# EAGLE design pic18f4550_dev (EAGLE 7.2.0)
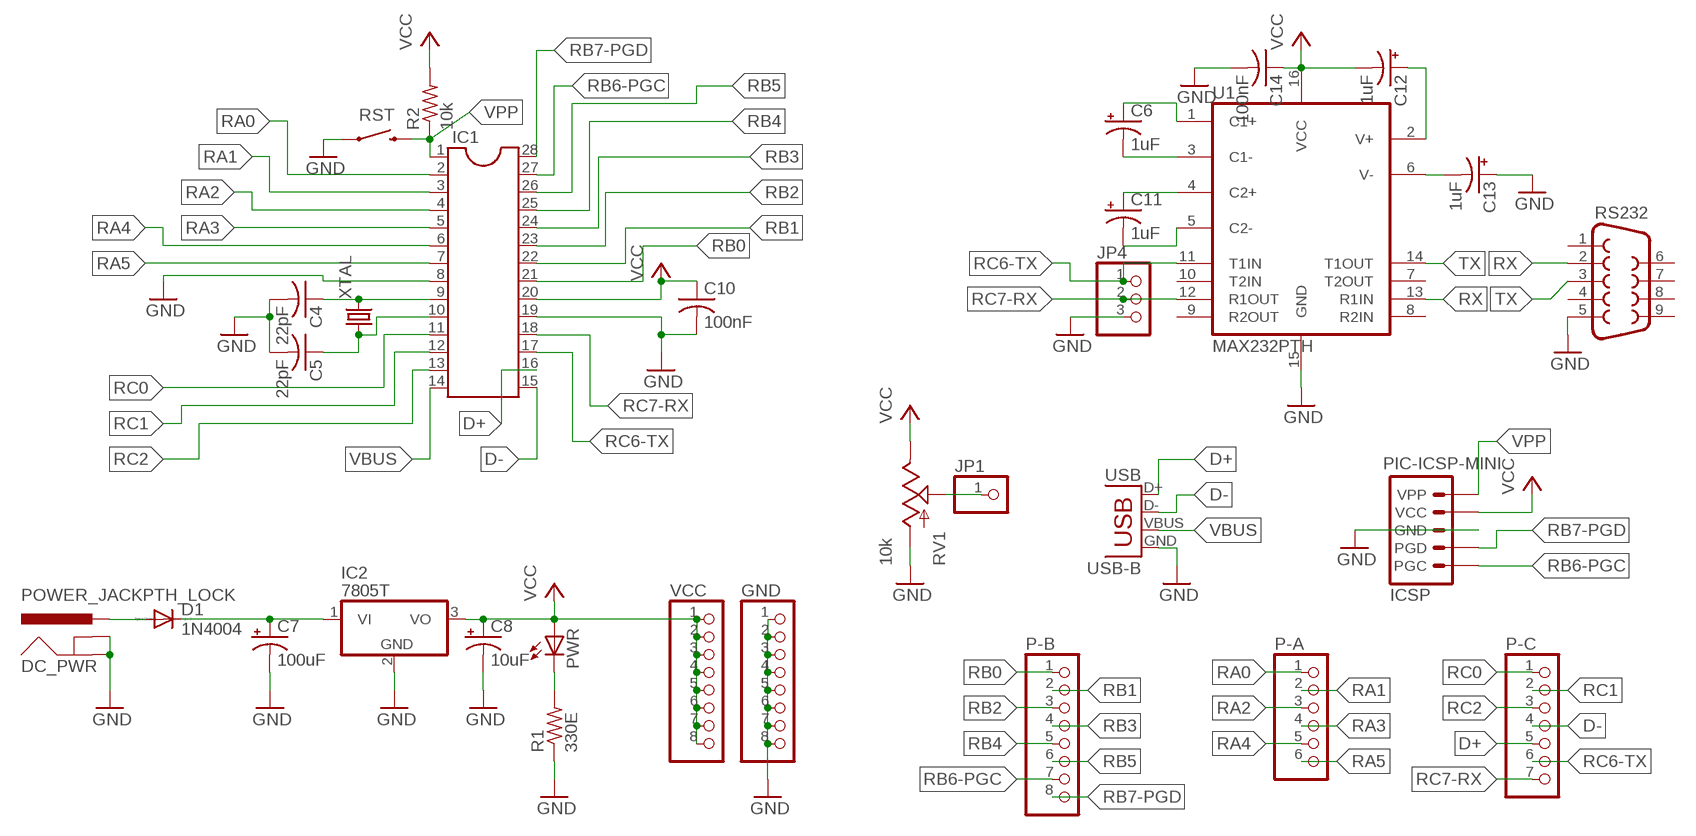
[diagram p0: schematic, sheet 1]

## Parts
C4  22pF  C-US025-024X044  [C025-024X044]
C5  22pF  C-US025-024X044  [C025-024X044]
C6  1uF  CAP_POLPTH2  [CPOL-RADIAL-10UF-25V]
C7  100uF  CAP_POLPTH1  [CPOL-RADIAL-100UF-25V]
C8  10uF  CAP_POLPTH2  [CPOL-RADIAL-10UF-25V]
C10  100nF  C-US025-025X050  [C025-025X050]
C11  1uF  CAP_POLPTH2  [CPOL-RADIAL-10UF-25V]
C12  1uF  CAP_POLPTH2  [CPOL-RADIAL-10UF-25V]
C13  1uF  CAP_POLPTH2  [CPOL-RADIAL-10UF-25V]
C14  100nF  C-US025-025X050  [C025-025X050]
D1  1N4004  [DO41-10]
DC_PWR  POWER_JACKPTH_LOCK  [POWER_JACK_PTH_LOCK]
GND  PINHD-1X8  [1X08]
IC1  DIL28-3  [DIL28-3]
IC2  7805T  [TO220H]
ICSP  PIC-ICSP-MINI  [PIC-ICSP-MINI]
JP1  PINHD-1X1  [1X01]
JP4  PINHD-1X3  [1X03]
P-A  PINHD-1X6  [1X06]
P-B  PINHD-1X8  [1X08]
P-C  PINHD-1X7  [1X07]
PWR  LED5MM  [LED5MM]
R1  330E  R-US_0204/7  [0204/7]
R2  10k  R-US_0204/7  [0204/7]
RS232  DB9FEMALE  [DB9]
RST  SWITCH-MOMENTARY-2PTH  [TACTILE-PTH]
RV1  10k  POTTRIM  [TRIM_POT]
U1  MAX232PTH  [DIL16]
USB  USB-B  USBPTH  [USB-B-PTH]
VCC  PINHD-1X8  [1X08]
XTAL  CRYSTALHC49S  [HC49/S]

## Nets
D+: IC1.16 P-C.5 USB.D+
D-: IC1.15 P-C.4 USB.D-
GND: C4.2 C5.2 C7.2(-) C8.2(-) C10.2 C13.1(+) C14.2 DC_PWR.GND DC_PWR.GNDBREAK GND.1 GND.2 GND.3 GND.4 GND.5 GND.6 GND.7 GND.8 IC1.8 IC1.19 IC2.2(GND) ICSP.3(GND) JP4.3 R1.1 RS232.5 RST.1 RV1.3(A) U1.15(GND) USB.GND
N$1: C6.1(+) U1.1(C1+)
N$2: C4.1 IC1.9 XTAL.2
N$3: C5.1 IC1.10 XTAL.1
N$4: C7.1(+) D1.C IC2.1(VI)
N$5: C6.2(-) U1.3(C1-)
N$6: C11.1(+) U1.4(C2+)
N$7: C11.2(-) U1.5(C2-)
N$8: C12.1(+) U1.2(V+)
N$9: C13.2(-) U1.6(V-)
N$10: PWR.K(C) R1.2
N$11: D1.A DC_PWR.PWR
N$12: JP1.1 RV1.1(S)
RA0: IC1.2 P-A.1
RA1: IC1.3 P-A.2
RA2: IC1.4 P-A.3
RA3: IC1.5 P-A.4
RA4: IC1.6 P-A.5
RA5: IC1.7 P-A.6
RB0: IC1.21 P-B.1
RB1: IC1.22 P-B.2
RB2: IC1.23 P-B.3
RB3: IC1.24 P-B.4
RB4: IC1.25 P-B.5
RB5: IC1.26 P-B.6
RB6-PGC: IC1.27 ICSP.5(PGC) P-B.7
RB7-PGD: IC1.28 ICSP.4(PGD) P-B.8
RC0: IC1.11 P-C.1
RC1: IC1.12 P-C.2
RC2: IC1.13 P-C.3
RC6-TX: IC1.17 JP4.1 P-C.6 U1.11(T1IN)
RC7-RX: IC1.18 JP4.2 P-C.7 U1.12(R1OUT)
RX: RS232.2 U1.13(R1IN)
TX: RS232.3 U1.14(T1OUT)
VBUS: IC1.14 USB.VBUS
VCC: C8.1(+) C10.1 C12.2(-) C14.1 IC1.20 IC2.3(VO) ICSP.2(VCC) PWR.A R2.2 RV1.2(E) U1.16(VCC) VCC.1 VCC.2 VCC.3 VCC.4 VCC.5 VCC.6 VCC.7 VCC.8
VPP: IC1.1 ICSP.1(VPP) R2.1 RST.3
Unconnected: RS232.1 RS232.4 RS232.6 RS232.7 RS232.8 RS232.9 U1.7(T2OUT) U1.8(R2IN) U1.9(R2OUT) U1.10(T2IN)

## Library data of the parts
C4 C5 C10 C14 = resistor:C-US: CAPACITOR, American symbol
C6-C8 C11-C13 = SparkFun-Capacitors:CAP_POL: Capacitor Polarized These are standard SMD and PTH capacitors. Normally 10uF, 47uF, and 100uF in electrolytic and tantalum varieties. Always verify the external diameter of the through hole cap, it varies with capacity, voltage, and manufacturer. The EIA devices should be standard.
D1 = diode:1N4004: DIODE general purpose rectifier, 1 A
DC_PWR = SparkFun-Connectors:POWER_JACK: Power Jack This is the standard 5.5mm barrel jack for power. The PTH is the most common, proven, reliable, footprint. The Slot footprint only works if the mill layer is transmitted to the PCB fab house so be warned. Mating wall wart : TOL-00298 (and others); PROD_ID: CONN-08197; SF_ID: PRT-00119
GND P-B VCC = pinhead:PINHD-1X8: PIN HEADER
IC1 = ic-package:DIL28: Dual In Line
IC2 = linear:78*: Positive VOLTAGE REGULATOR Source: http://cache.national.com/ds/LM/LM78L05.pdf http://www.fairchildsemi.com/ds/LM/LM7805.pdf
ICSP = SparkFun-Connectors:PIC-ICSP-MINI: PIC-ICSP-Mini Miniature 5-pin connection for temporary programming of PICs. Use this device in your design to save space. Program the PIC with this adapter Spark Fun Electronics SKU : BOB-00194
JP1 = pinhead:PINHD-1X1: PIN HEADER
JP4 = pinhead:PINHD-1X3: PIN HEADER
P-A = pinhead:PINHD-1X6: PIN HEADER
P-C = pinhead:PINHD-1X7: PIN HEADER
PWR = led:LED: LED OSRAM: - CHIPLED LG R971, LG N971, LY N971, LG Q971, LY Q971, LO R971, LY R971 LH N974, LH R974 LS Q976, LO Q976, LY Q976 LO Q996 - Hyper CHIPLED LW Q18S LB Q993, LB Q99A, LB R99A - SideLED LS A670, LO A670, LY A670, LG A670, LP A670 LB A673, LV A673, LT A673, LW A673 LH A674 LY A675 LS A676, LA A676, LO A676, LY A676, LW A676 LS A679, LY A679, LG A679 - Hyper Micro SIDELED® LS Y876, LA Y876, LO Y876, LY Y876 LT Y87S - SmartLED LW L88C, LW L88S LB L89C, LB L89S, LG L890 LS L89K, LO L89K, LY L89K LS L896, LA L896, LO L896, LY L896 - TOPLED LS T670, LO T670, LY T670, LG T670, LP T670 LSG T670, LSP T670, LSY T670, LOP T670, LYG T670 LG T671, LOG T671, LSG T671 LB T673, LV T673, LT T673, LW T673 LH T674 LS T676, LA T676, LO T676, LY T676, LB T676, LH T676, LSB T676, LW T676 LB T67C, LV T67C, LT T67C, LS T67K, LO T67K, LY T67K, LW E67C LS E67B, LA E67B, LO E67B, LY E67B, LB E67C, LV E67C, LT E67C LW T67C LS T679, LY T679, LG T679 LS T770, LO T770, LY T770, LG T770, LP T770 LB T773, LV T773, LT T773, LW T773 LH T774 LS E675, LA E675, LY E675, LS T675 LS T776, LA T776, LO T776, LY T776, LB T776 LHGB T686 LT T68C, LB T68C - Hyper Mini TOPLED® LB M676 - Mini TOPLED Santana® LG M470 LS M47K, LO M47K, LY M47K Source: http://www.osram.convergy.de LUXEON: - LUMILED® LXK2-PW12-R00, LXK2-PW12-S00, LXK2-PW14-U00, LXK2-PW14-V00 LXK2-PM12-R00, LXK2-PM12-S00, LXK2-PM14-U00 LXK2-PE12-Q00, LXK2-PE12-R00, LXK2-PE12-S00, LXK2-PE14-T00, LXK2-PE14-U00 LXK2-PB12-K00, LXK2-PB12-L00, LXK2-PB12-M00, LXK2-PB14-N00, LXK2-PB14-P00, LXK2-PB14-Q00 LXK2-PR12-L00, LXK2-PR12-M00, LXK2-PR14-Q00, LXK2-PR14-R00 LXK2-PD12-Q00, LXK2-PD12-R00, LXK2-PD12-S00 LXK2-PH12-R00, LXK2-PH12-S00 LXK2-PL12-P00, LXK2-PL12-Q00, LXK2-PL12-R00 Source: www.luxeon.com KINGBRIGHT: KA-3528ASYC Source: www.kingbright.com
R1 R2 = resistor:R-US_: RESISTOR, American symbol
RS232 = SparkFun-Connectors:DB9: DB9 Connector Standard DB9 (D-Sub 9) serial connector. Can be used for CAN bus as well as RS485 and RS232. Footprint production proven. Spark Fun Electronics SKU : PRT-00429; PROD_ID: CONN-08194
RST = SparkFun-Electromechanical:SWITCH-MOMENTARY-2: Various NO switches- pushbuttons, reed, etc; PROD_ID: SWCH-08441
RV1 = SparkFun-Electromechanical:POT
U1 = SparkFun-DigitalIC:MAX232: RS232 Transceiver Very common IC. This is generically called 'MAX232', but works with the 3V equivalent MAX3232 generic ICs. Field tested and mother approved. Spark Fun Electronics SKU : COM-00316 (DIP) and COM-00589 (SMD)
USB = SparkFun-Connectors:USB: USB Connectors USB-B-PTH is fully proven SKU : PRT-00139/CONN-08278 USB-miniB is fully proven SKU : PRT-00587 USB-A-PCB is untested. USB-A-H is throughly reviewed, but untested. Spark Fun Electronics SKU : PRT-00437 USB-B-SMT is throughly reviewed, but untested. Needs silkscreen touching up. USB-A-S has not been used/tested USB-MB-H has not been used/tested USB-MICROB has been used. CONN-09505; PROD_ID: CONN-08278
XTAL = crystal:CRYSTAL: CRYSTAL; OC_FARNELL: 1667008; OC_NEWARK: unknown

## Board
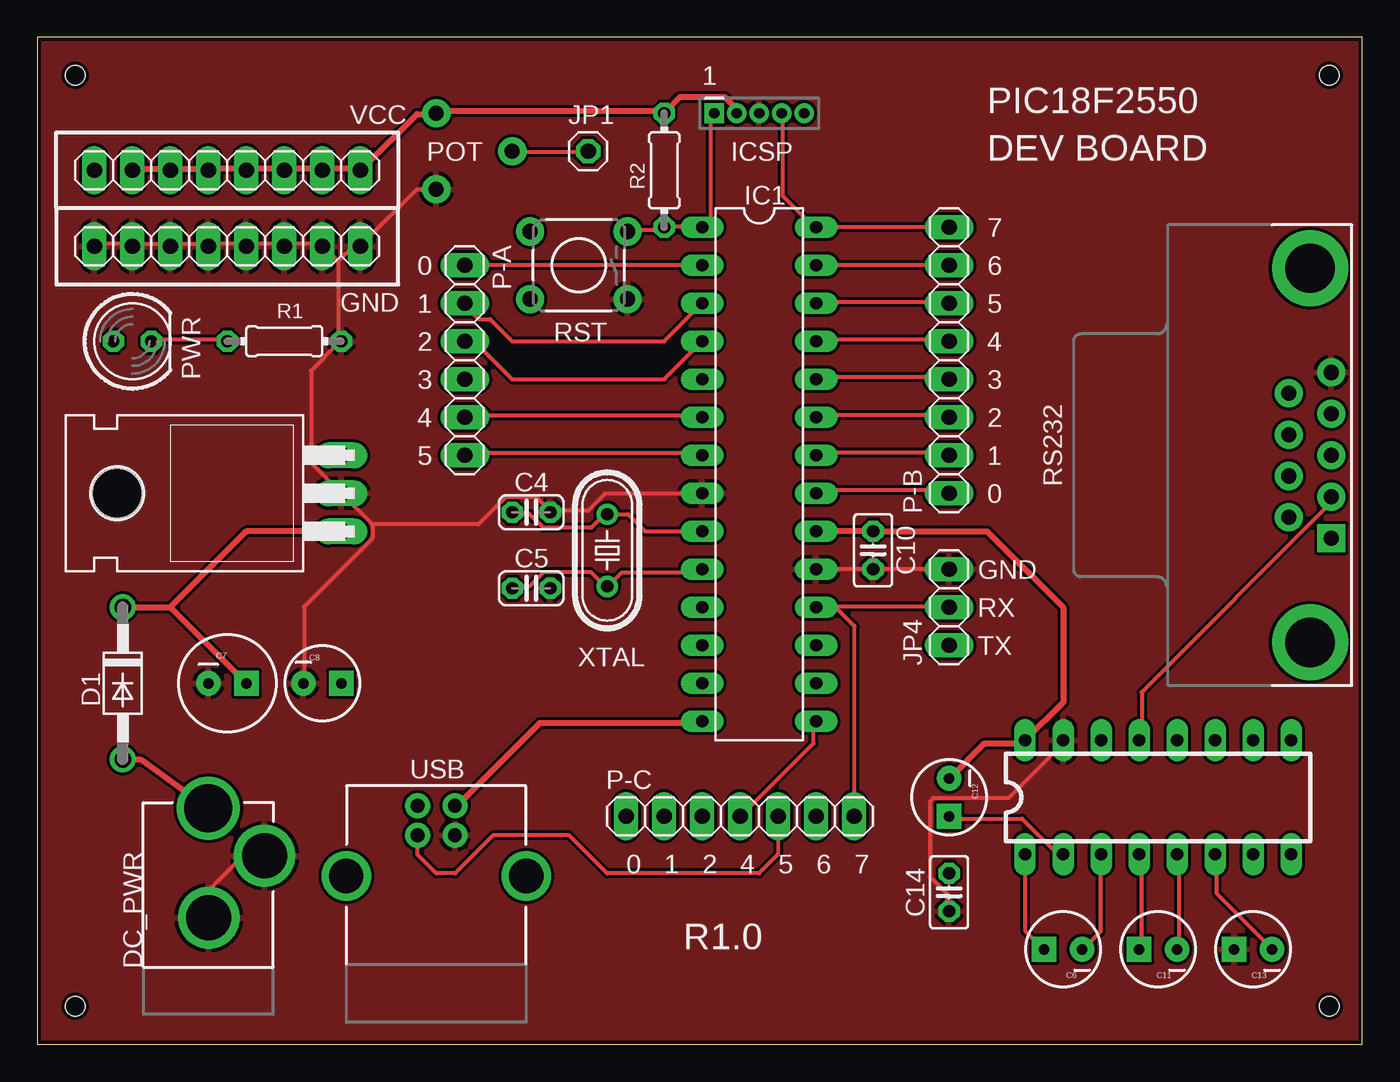
[diagram p1: board, top side]
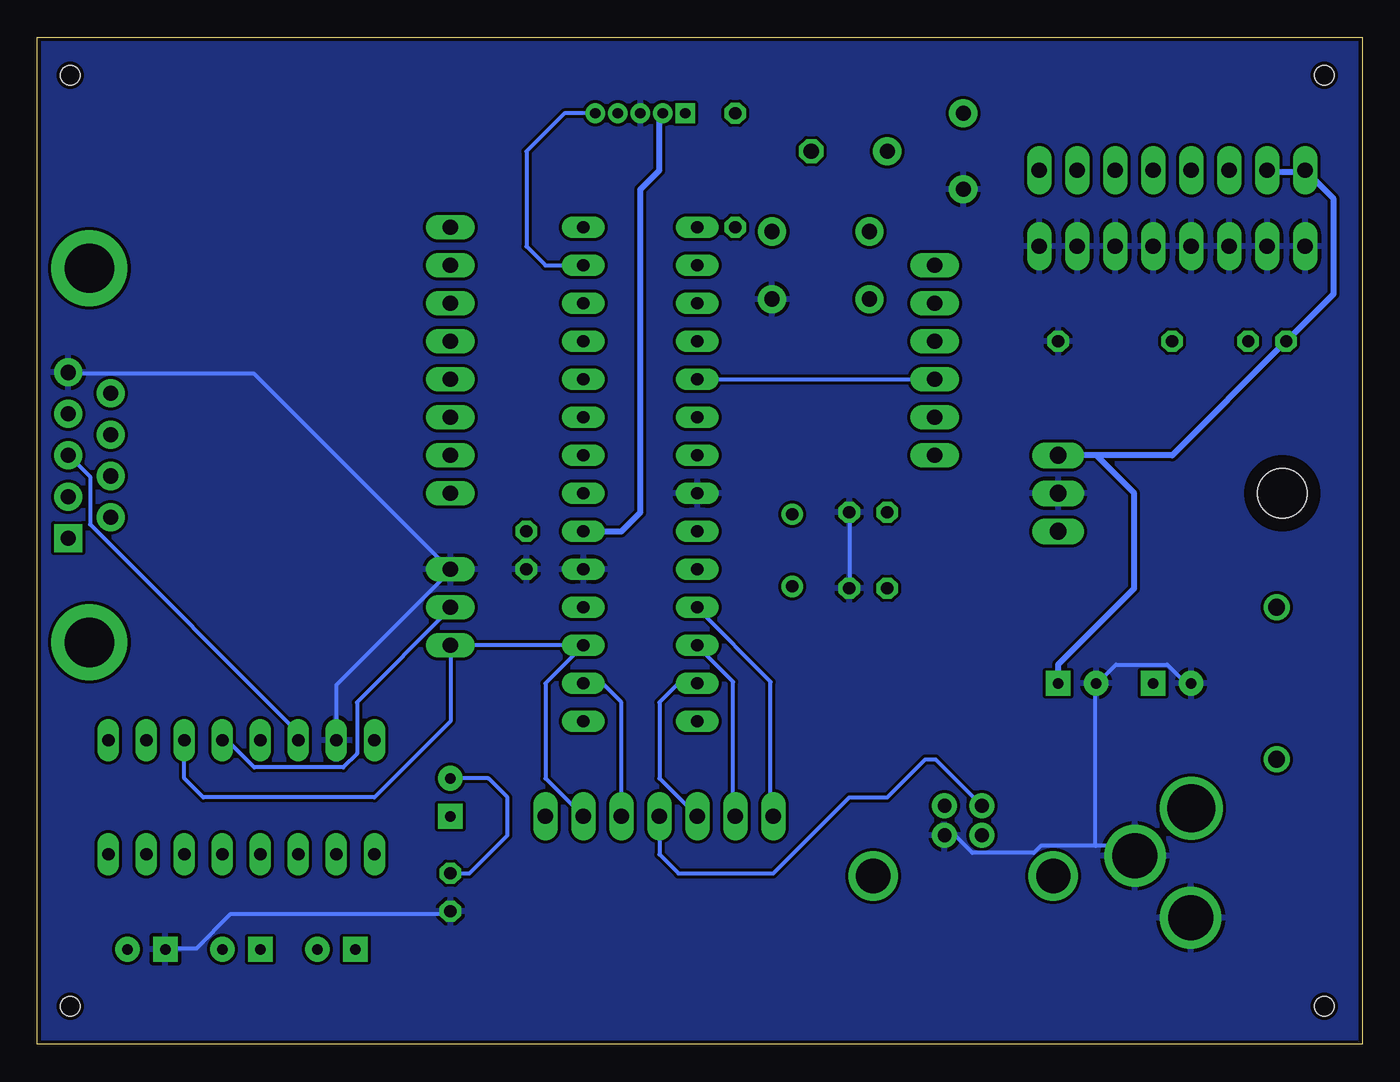
[diagram p2: board, bottom side, seen from below]

Size 88.57 x 67.3 mm. Coordinates in mm from the lower left corner, seen from the top.
Outline: 0,0 88.57,0 88.57,67.3 0,67.3 0,0
Copper layers (1*16): Top 0.035mm / dielectric 1.5mm / Bottom 0.035mm
Design rules "SparkFun": minimum track width 8mil, minimum drill 20mil, track to track 8mil, track to pad 8mil, pad to pad 8mil, via to via 8mil, smd to smd 8mil, copper to edge 10mil, drill to drill 8mil, minimum pad ring 12mil, minimum via ring 10mil, stop-mask expansion 4mil, vias tented up to drill 25mil, thermal gap 10mil
Holes 1.3 mm at 2.54,64.77 86.36,64.77 86.36,2.54 2.54,2.54

### Footprints (pad centres in the part's own frame; a part is rotated, then mirrored left to right if it is on the bottom)
C025-024X044 = drill 0.813 octagon: 1 -1.27,0; 2 1.27,0
CPOL-RADIAL-10UF-25V = drill 0.7 pad 1.651 square: 1 1.27,0 | drill 0.7 pad 1.651: 2 -1.27,0
CPOL-RADIAL-100UF-25V = drill 0.7 pad 1.651 square: 1 1.27,0 | drill 0.7 pad 1.651: 2 -1.27,0
C025-025X050 = drill 0.813 octagon: 1 -1.27,0; 2 1.27,0
DO41-10 = drill 1.118: A 5.08,0; C -5.08,0
POWER_JACK_PTH_LOCK = drill 2.997 pad 4.115: GND 0.025,6.557; GNDBREAK 3.762,10.7 | drill 3.2 pad 4.115: PWR 0,13.878
1X08 = drill 1.016 long: 1 -8.89,0; 2 -6.35,0; 3 -3.81,0; 4 -1.27,0; 5 1.27,0; 6 3.81,0; 7 6.35,0; 8 8.89,0
DIL28-3 = drill 0.813 long: 1 -16.51,-3.81; 2 -13.97,-3.81; 3 -11.43,-3.81; 4 -8.89,-3.81; 5 -6.35,-3.81; 6 -3.81,-3.81; 7 -1.27,-3.81; 8 1.27,-3.81; 9 3.81,-3.81; 10 6.35,-3.81; 11 8.89,-3.81; 12 11.43,-3.81; 13 13.97,-3.81; 14 16.51,-3.81; 15 16.51,3.81; 16 13.97,3.81; 17 11.43,3.81; 18 8.89,3.81; 19 6.35,3.81; 20 3.81,3.81; 21 1.27,3.81; 22 -1.27,3.81; 23 -3.81,3.81; 24 -6.35,3.81; 25 -8.89,3.81; 26 -11.43,3.81; 27 -13.97,3.81; 28 -16.51,3.81
TO220H = drill 1.118 long: 1 -2.54,-10.16; 2 0,-10.16; 3 2.54,-10.16 | hole 3.302: 0,4.826
PIC-ICSP-MINI = drill 0.7 square: 1 -3,0 | drill 0.7: 2 -1.5,0; 3 0,0; 4 1.5,0; 5 3,0
1X01 = drill 1.016 octagon: 1 0,0
1X03 = drill 1.016 long: 1 -2.54,0; 2 0,0; 3 2.54,0
1X06 = drill 1.016 long: 1 -6.35,0; 2 -3.81,0; 3 -1.27,0; 4 1.27,0; 5 3.81,0; 6 6.35,0
1X07 = drill 1.016 long: 1 -7.62,0; 2 -5.08,0; 3 -2.54,0; 4 0,0; 5 2.54,0; 6 5.08,0; 7 7.62,0
LED5MM = drill 0.813 octagon: A -1.27,0; K 1.27,0
0204/7 = drill 0.813 octagon: 1 -3.81,0; 2 3.81,0
DB9 = drill 1.016 pad 1.88 square: 1 -5.54,-1.42 | drill 1.016 pad 1.88: 2 -2.77,-1.42; 3 0,-1.42; 4 2.77,-1.42; 5 5.54,-1.42; 6 -4.15,1.42; 7 -1.38,1.42; 8 1.38,1.42; 9 4.15,1.42 | drill 3.302 pad 5.08: G1 -12.5,0; G2 12.5,0
TACTILE-PTH = drill 1.016 pad 1.88: 1 -3.251,2.261; 2 3.251,2.261; 3 -3.251,-2.261; 4 3.251,-2.261
TRIM_POT = drill 1 pad 1.88: 1 5.08,0; 2 0,2.54; 3 0,-2.54
DIL16 = drill 0.813 long: 1 -8.89,-3.81; 2 -6.35,-3.81; 3 -3.81,-3.81; 4 -1.27,-3.81; 5 1.27,-3.81; 6 3.81,-3.81; 7 6.35,-3.81; 8 8.89,-3.81; 9 8.89,3.81; 10 6.35,3.81; 11 3.81,3.81; 12 1.27,3.81; 13 -1.27,3.81; 14 -3.81,3.81; 15 -6.35,3.81; 16 -8.89,3.81
USB-B-PTH = drill 0.914 pad 1.676: D+ 0,1.25; D- 1.981,1.25; GND 0,-1.25; VBUS 1.981,-1.25 | drill 2.286: S1 -2.718,-6.02; S2 -2.718,6.02
HC49/S = drill 0.813: 1 -2.413,0; 2 2.413,0

### Placement (x,y rotation side)
C4  33.02,35.56 0 top
C5  33.02,30.48 0 top
C6  68.58,6.35 180 top
C7  12.7,24.13 0 top
C8  19.05,24.13 0 top
C10  55.88,33.02 270 top
C11  74.93,6.35 180 top
C12  60.96,16.51 270 top
C13  81.28,6.35 180 top
C14  60.96,10.16 270 top
D1  5.71,24.13 270 top
DC_PWR  11.43,1.91 0 top
GND  12.7,53.34 180 top
IC1  48.26,38.1 270 top
IC2  10.16,36.83 90 top
ICSP  48.26,62.23 0 top
JP1  36.83,59.69 0 top
JP4  60.96,29.21 90 top
P-A  28.57,45.72 270 top
P-B  60.96,45.72 90 top
P-C  46.99,15.24 0 top
PWR  6.35,46.99 0 top
R1  16.51,46.99 180 top
R2  41.91,58.42 90 top
RS232  85.09,39.37 90 top
RST  36.2,52.07 180 top
RV1  26.67,59.69 0 top
U1  74.93,16.51 0 top
USB  26.67,13.97 90 top
VCC  12.7,58.42 0 top
XTAL  38.1,33.02 90 top

### Tracks (layer width: path | path; a pad name or v marks a point on that pad's centre or on a via)
D+
  Top 0.254: P-C.5 49.53,12.7 48.26,11.43 38.1,11.43 35.56,13.97 30.48,13.97 27.94,11.43 26.67,11.43 25.42,12.68 USB.D+
  Bottom 0.254: P-C.5 49.53,22.86 50.8,24.13 IC1.16
D-
  Top 0.254: IC1.15 51.89,21.49 51.89,20.12 47.09,15.32 P-C.4
  Bottom 0.254: P-C.4 46.99,12.7 45.72,11.43 39.37,11.43 34.29,16.51 31.75,16.51 29.21,19.05 28.52,19.05 USB.D-
GND
  Top 0.254: DC_PWR.GND 10.29,8.69 10.29,9.14 13.72,12.57 DC_PWR.GNDBREAK | GND.8 3.89,53.49 6.17,53.49 GND.7 6.4,53.49 8.69,53.49 GND.6 8.91,53.49 11.43,53.49 | 20.12,52.35 20.12,47.09 R1.1 20.12,46.86 18.29,45.03 18.29,38.86 IC2.2 22.4,34.75 | 20.12,52.35 19.2,53.26 GND.2 18.97,53.49 16.69,53.49 GND.3 16.46,53.49 14.17,53.49 GND.4 13.95,53.49 11.43,53.49 | 20.12,52.35 21.03,53.26 21.49,53.26 GND.1 21.72,53.49 25.38,57.15 RV1.3 | 11.43,53.49 GND.5 | 22.4,34.75 22.4,33.83 17.83,29.26 17.83,24.23 C8.2 | C14.2 60.81,8.91 60.81,10.06 59.66,11.2 59.66,16.23 59.89,16.46 64.92,16.46 68.58,20.12 U1.15 | IC1.19 52.12,31.77 55.78,31.77 C10.2 56.01,31.77 60.81,31.77 JP4.3 | 34.29,35.66 36.8,35.66 37.95,36.8 44.35,36.8 IC1.8 | 22.4,34.75 29.49,34.75 31.32,36.58 33.38,36.58 34.29,35.66 | 34.29,35.66 C4.2
  Bottom 0.254: C7.2 11.43,24.23 11.89,24.23 13.03,25.38 16.46,25.38 17.6,24.23 C8.2 17.83,24 17.83,13.26 | 17.83,13.26 14.4,13.26 13.95,12.8 DC_PWR.GNDBREAK | 17.83,13.26 21.49,13.26 21.95,12.8 26.06,12.8 27.2,13.95 27.89,13.95 USB.GND | C13.1 80.01,6.4 77.95,6.4 75.67,8.69 61.04,8.69 C14.2 | C4.2 C5.2 | RS232.5 86.41,44.81 74.07,44.81 61.04,31.77 JP4.3 61.04,31.55 68.58,24 U1.15
  pour Bottom: -1.27,67.31 90.17,67.31 90.17,0 -1.27,0
  pour Top: -2.54,69.85 92.71,69.85 92.71,-1.27 -2.54,-1.27
N$1
  Top 0.254: U1.1 66.06,12.57 66.06,7.54 67.21,6.4 C6.1
N$2
  Top 0.254: C4.1 31.77,35.43 32.92,35.43 33.83,34.52 37.03,34.52 37.95,35.43 XTAL.2 39.5,35.43 40.64,34.29 IC1.9
N$3
  Top 0.254: C5.1 31.77,30.63 32.92,30.63 33.83,31.55 37.03,31.55 37.95,30.63 XTAL.1 38.18,30.63 39.09,31.55 44.35,31.55 IC1.10
N$4
  Top 0.406: D1.C 8.89,29.21 | 8.89,29.21 C7.1 | IC2.1 13.97,34.29 8.89,29.21
N$5
  Top 0.254: U1.3 71.09,12.57 71.09,7.54 69.95,6.4 C6.2
N$6
  Top 0.254: U1.4 73.84,12.57 73.84,6.4 C11.1
N$7
  Top 0.254: U1.5 76.35,12.57 76.35,6.4 C11.2
N$8
  Top 0.254: U1.2 68.58,12.8 68.12,12.8 65.84,15.09 61.04,15.09 C12.1
N$9
  Top 0.254: U1.6 78.87,12.57 78.87,10.06 82.53,6.4 C13.2
N$10
  Top 0.254: PWR.K 7.77,47.09 12.57,47.09 R1.2
N$11
  Top 0.406: D1.A 6.89,19.05 DC_PWR.PWR
N$12
  Top 0.254: JP1.1 36.8,59.66 31.77,59.66 RV1.1
RA0
  Top 0.254: IC1.2 44.35,52.12 28.57,52.12 P-A.1
RA1
  Top 0.254: 44.35,49.38 IC1.3 41.91,46.99 31.75,46.99 30.28,48.46 29.49,48.46 28.57,49.38 P-A.2
RA2
  Top 0.254: 44.35,47.09 IC1.4 41.91,44.45 31.75,44.45 29.11,47.09 28.57,47.09 P-A.3
RA3
  Bottom 0.254: IC1.5 P-A.4
RA4
  Top 0.254: IC1.6 44.35,42.06 28.57,42.06 P-A.5
RA5
  Top 0.254: IC1.7 44.35,39.55 28.57,39.55 P-A.6
RB0
  Top 0.254: IC1.21 52.12,37.03 60.81,37.03 P-B.1
RB1
  Top 0.254: IC1.22 52.12,39.55 60.81,39.55 P-B.2
RB2
  Top 0.254: IC1.23 52.12,42.06 60.81,42.06 P-B.3
RB3
  Top 0.254: IC1.24 52.12,44.58 60.81,44.58 P-B.4
RB4
  Top 0.254: IC1.25 52.12,47.09 60.81,47.09 P-B.5
RB5
  Top 0.254: IC1.26 52.12,49.61 60.81,49.61 P-B.6
RB6-PGC
  Top 0.254: P-B.7 60.81,52.12 52.12,52.12 IC1.27
  Bottom 0.254: ICSP.5 53.34,62.23 55.88,59.69 55.88,53.34 54.61,52.07 IC1.27
RB7-PGD
  Top 0.254: ICSP.4 49.84,62.18 49.84,56.69 51.89,54.63 IC1.28 52.12,54.63 60.81,54.63 P-B.8
RC0
  Bottom 0.254: IC1.11 44.35,29.03 39.55,24.23 39.55,15.32 P-C.1
RC1
  Bottom 0.254: IC1.12 44.35,26.52 42.06,24.23 42.06,15.32 P-C.2
RC2
  Bottom 0.254: IC1.13 45.72,24.13 46.99,22.86 46.99,17.78 P-C.3
RC6-TX
  Bottom 0.254: P-C.6 54.61,17.78 54.61,24.13 IC1.17 JP4.1 60.96,21.59 66.04,16.51 77.47,16.51 78.74,17.78 U1.11
RC7-RX
  Top 0.254: 53.34,29.26 60.81,29.26 JP4.2 | 53.34,29.26 52.12,29.26 IC1.18 | P-C.7 54.63,15.32 54.63,27.91 54.61,27.94 54.61,27.99 53.34,29.26
  Bottom 0.254: U1.12 76.12,20.12 75.67,20.12 74.07,18.52 68.12,18.52 67.21,19.43 67.21,22.86 61.04,29.03 JP4.2
RX
  Top 0.254: U1.13 73.84,20.34 73.84,23.55 86.41,36.12 86.41,36.58 RS232.2
TX
  Bottom 0.254: U1.14 71.32,20.34 71.32,21.03 85.04,34.75 85.04,37.95 86.41,39.32 RS232.3
VBUS
  Top 0.406: IC1.14 44.35,21.49 33.6,21.49 28.12,16 USB.VBUS
VCC
  Top 0.254: 8.91,58.52 VCC.3 | 65.84,20.12 U1.16 | 61.04,17.83 C12.2 | 46.63,62.64 46.63,62.41 | 42.06,62.41 R2.2 | 16.46,58.52 VCC.6 | 21.49,58.52 VCC.8 | 26.52,62.18 RV1.2 | 18.97,58.52 VCC.7 | 11.43,58.52 VCC.4 | 13.95,58.52 VCC.5
  Top 0.406: VCC.3 8.69,58.52 6.4,58.52 VCC.2 | 8.91,58.52 11.43,58.52 13.95,58.52 | IC1.20 C10.1 63.5,34.29 68.58,29.21 68.58,22.86 U1.16 | 65.84,20.12 63.32,20.12 61.04,17.83 | 46.63,62.64 45.95,63.32 42.98,63.32 42.06,62.41 | 46.63,62.41 ICSP.2 | 16.46,58.52 14.17,58.52 VCC.5 | 21.49,58.52 19.2,58.52 VCC.7 | 26.52,62.18 25.38,62.18 21.72,58.52 VCC.8 | 18.97,58.52 16.69,58.52 VCC.6 | R2.2 41.83,62.41 26.75,62.41 RV1.2
  Bottom 0.254: 5.26,47.09 PWR.A | C14.1 59.69,11.43 57.15,13.97 57.15,16.51 58.42,17.78 C12.2 | 46.99,62 ICSP.2
  Bottom 0.406: C8.1 20.32,25.4 15.24,30.48 15.24,36.83 17.78,39.37 | 17.78,39.37 IC2.3 | 17.78,39.37 12.7,39.37 5.26,46.81 5.26,47.09 4.98,47.09 1.91,50.16 1.91,56.52 VCC.1 3.89,58.29 6.35,58.29 VCC.2 | IC1.20 49.53,34.29 48.26,35.56 48.26,57.15 46.99,58.42 46.99,62
VPP
  Top 0.254: ICSP.1 45.03,62.18 45.03,55.09 44.58,54.63 IC1.1 44.35,54.63 42.06,54.63 R2.1 41.83,54.41 39.55,54.41 RST.3

### Text on the board
tPlace: 1 | PIC18F2550 | POT | ICSP | DEV BOARD | 7 | 0 | 6 | 1 | 5 | 2 | 4 | 3 | 3 | 4 | 2 | 5 | 1 | 0 | GND | RX | TX | 0 | 1 | 2 | 4 | 5 | 6 | 7 | R1.0